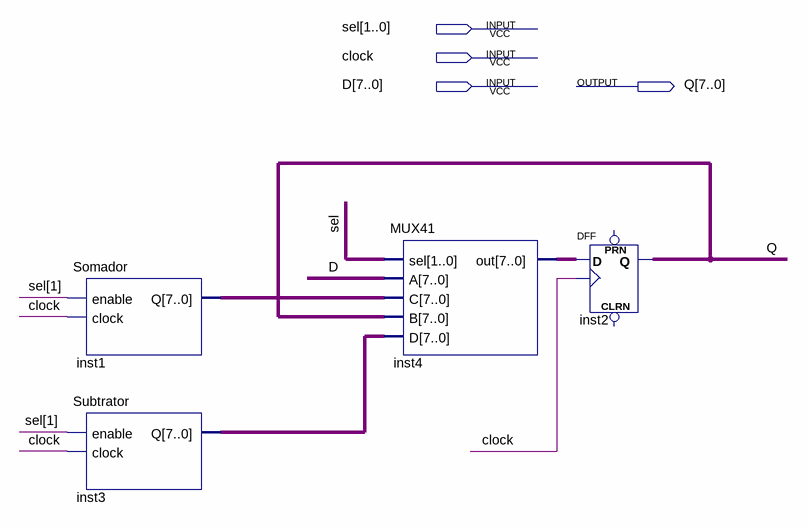
[diagram p0: schematic sheet]
// Quartus schematic ContadorUpDown.bdf as structural Verilog: 4 symbols, 4 pins
module ContadorUpDown (
  input  [1:0] sel,
  input  clock,
  input  [7:0] D,
  output [7:0] Q
);

  wire D_1bit, Q_1bit, sel_1bit;
  wire [7:0] inst1_q, inst3_q, inst4_out;

  Somador inst1 (.enable(sel[1]), .clock(clock), .Q(inst1_q));
  Subtrator inst3 (.enable(sel[1]), .clock(clock), .Q(inst3_q));
  MUX41 inst4 (.sel({2{sel_1bit}}), .A({8{D_1bit}}), .C(inst1_q), .B({8{Q_1bit}}), .D(inst3_q), .out(inst4_out));
  DFF inst2[7:0] (.CLK(clock), .D(inst4_out), .Q(Q_1bit));  // open: CLRN, PRN
endmodule
